# Altium schematic sheet Temperature_Monitoring.SchDoc
size A4
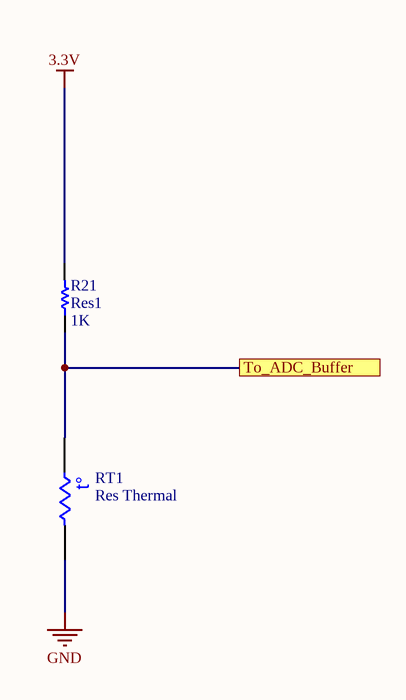
[diagram p0: Temperature_Monitoring.SchDoc]

## Parts
R21  Res1  value 1K  [AXIAL-0.3]
RT1  Res Thermal  [6-0805_N]

## Ports
To_ADC_Buffer

## Nets
3.3V: R21.2
GND: RT1.2
To_ADC_Buffer: R21.1 RT1.1 ; port To_ADC_Buffer

## Notes on the sheet
- (in symbol Res Thermal) t°

## Library data of the parts
R21 = Res1: Resistor; Published: 8-Jun-2000; LatestRevisionDate: 17-Jul-2002; LatestRevisionNote: Re-released for DXP Platform.; PackageReference: AXIAL-0.3; Publisher: Altium Limited; PackageDescription: Axial Device, Thru-Hole; 2 Leads; 0.3 in Pin Spacing
RT1 = Res Thermal: Thermistor; Published: 24-Mar-1999; LatestRevisionDate: 29-May-2009; LatestRevisionNote: IPC-7351 Footprint Added.; PackageVersion: Mar-2003; PackageReference: 6-0805; Publisher: Altium Limited; PackageDescription: Chip Resistor 0805 Case Size; Code_IPC: RESC2012